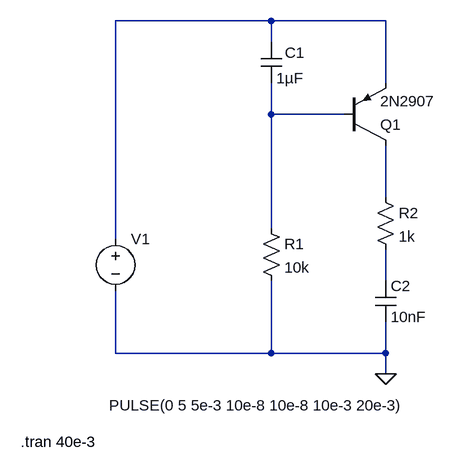
[diagram p0: schematic Delay.asc]
Delay.asc, the LTspice schematic file:
Version 4
SHEET 1 912 680
WIRE 288 -224 48 -224
WIRE 464 -224 288 -224
WIRE 288 -192 288 -224
WIRE 464 -128 464 -224
WIRE 288 -80 288 -128
WIRE 400 -80 288 -80
WIRE 464 48 464 -32
WIRE 288 96 288 -80
WIRE 48 112 48 -224
WIRE 464 176 464 128
WIRE 48 288 48 192
WIRE 288 288 288 176
WIRE 288 288 48 288
WIRE 464 288 464 240
WIRE 464 288 288 288
WIRE 464 320 464 288
FLAG 464 320 0
SYMBOL voltage 48 96 R0
WINDOW 3 -10 272 Left 2
WINDOW 123 0 0 Left 0
WINDOW 39 0 0 Left 0
SYMATTR InstName V1
SYMATTR Value PULSE(0 5 5e-3 10e-8 10e-8 10e-3 20e-3)
SYMBOL res 272 80 R0
SYMATTR InstName R1
SYMATTR Value 10k
SYMBOL res 448 32 R0
SYMATTR InstName R2
SYMATTR Value 1k
SYMBOL cap 448 176 R0
SYMATTR InstName C2
SYMATTR Value 10nF
SYMBOL cap 272 -192 R0
WINDOW 0 37 17 Left 2
SYMATTR InstName C1
SYMATTR Value 1µF
SYMBOL pnp 400 -32 M180
SYMATTR InstName Q1
SYMATTR Value 2N2907
TEXT -98 424 Left 2 !.tran 40e-3

The netlist it stands for:
* Delay.asc
V1 N001 0 PULSE(0 5 5e-3 10e-8 10e-8 10e-3 20e-3)
R1 N002 0 10k
R2 N003 N004 1k
C2 N004 0 10nF
C1 N001 N002 1µF
Q1 N003 N002 N001 0 2N2907
.model NPN NPN
.model PNP PNP
.lib standard.bjt
.tran 40e-3
.backanno
.end